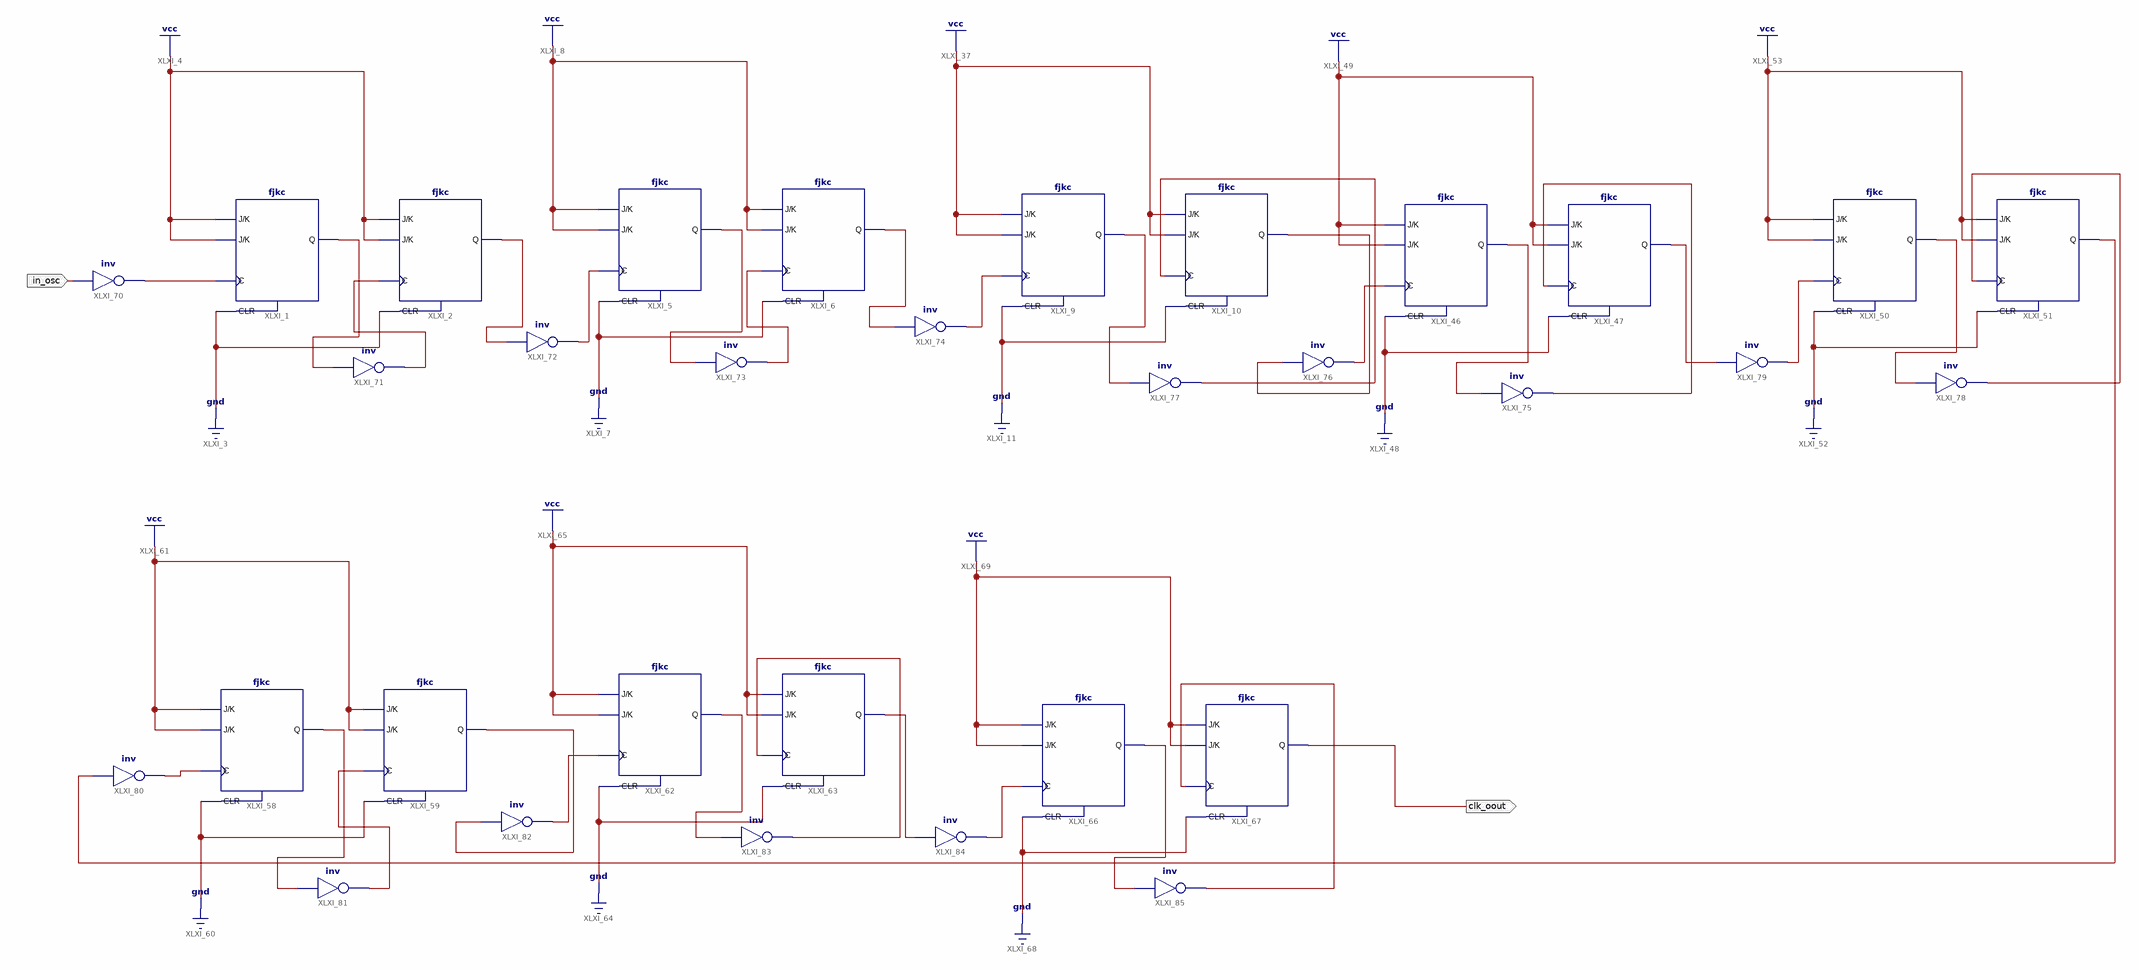
[diagram p0: schematic sheet 1]
// Xilinx ISE schematic clk_2_16.sch (spartan6) as structural Verilog: 32 symbols, 2 ports
module clk_2_16 (
  input  in_osc,
  output clk_oout
);

  wire XLXN_86, XLXN_87, XLXN_88, XLXN_89, XLXN_90, XLXN_91, XLXN_92, XLXN_93, XLXN_94, XLXN_95, XLXN_96,
       XLXN_98, XLXN_100, XLXN_101, XLXN_102, XLXN_103, XLXN_104, XLXN_105, XLXN_106, XLXN_107, XLXN_108,
       XLXN_110, XLXN_111, XLXN_112, XLXN_113, XLXN_114, XLXN_115, XLXN_116, XLXN_117, XLXN_118, XLXN_119;

  fjkc XLXI_1 (.C(XLXN_86), .CLR(1'b0), .J(1'b1), .K(1'b1), .Q(XLXN_87));
  fjkc XLXI_2 (.C(XLXN_88), .CLR(1'b0), .J(1'b1), .K(1'b1), .Q(XLXN_89));
  fjkc XLXI_5 (.C(XLXN_90), .CLR(1'b0), .J(1'b1), .K(1'b1), .Q(XLXN_91));
  fjkc XLXI_6 (.C(XLXN_92), .CLR(1'b0), .J(1'b1), .K(1'b1), .Q(XLXN_93));
  fjkc XLXI_9 (.C(XLXN_94), .CLR(1'b0), .J(1'b1), .K(1'b1), .Q(XLXN_95));
  fjkc XLXI_10 (.C(XLXN_96), .CLR(1'b0), .J(1'b1), .K(1'b1), .Q(XLXN_98));
  fjkc XLXI_46 (.C(XLXN_100), .CLR(1'b0), .J(1'b1), .K(1'b1), .Q(XLXN_101));
  fjkc XLXI_47 (.C(XLXN_102), .CLR(1'b0), .J(1'b1), .K(1'b1), .Q(XLXN_103));
  fjkc XLXI_50 (.C(XLXN_104), .CLR(1'b0), .J(1'b1), .K(1'b1), .Q(XLXN_105));
  fjkc XLXI_51 (.C(XLXN_106), .CLR(1'b0), .J(1'b1), .K(1'b1), .Q(XLXN_108));
  fjkc XLXI_58 (.C(XLXN_107), .CLR(1'b0), .J(1'b1), .K(1'b1), .Q(XLXN_110));
  fjkc XLXI_59 (.C(XLXN_111), .CLR(1'b0), .J(1'b1), .K(1'b1), .Q(XLXN_112));
  fjkc XLXI_62 (.C(XLXN_113), .CLR(1'b0), .J(1'b1), .K(1'b1), .Q(XLXN_114));
  fjkc XLXI_63 (.C(XLXN_115), .CLR(1'b0), .J(1'b1), .K(1'b1), .Q(XLXN_116));
  fjkc XLXI_66 (.C(XLXN_117), .CLR(1'b0), .J(1'b1), .K(1'b1), .Q(XLXN_118));
  fjkc XLXI_67 (.C(XLXN_119), .CLR(1'b0), .J(1'b1), .K(1'b1), .Q(clk_oout));
  not XLXI_70 (XLXN_86, in_osc);
  not XLXI_71 (XLXN_88, XLXN_87);
  not XLXI_72 (XLXN_90, XLXN_89);
  not XLXI_73 (XLXN_92, XLXN_91);
  not XLXI_74 (XLXN_94, XLXN_93);
  not XLXI_75 (XLXN_102, XLXN_101);
  not XLXI_76 (XLXN_100, XLXN_98);
  not XLXI_77 (XLXN_96, XLXN_95);
  not XLXI_78 (XLXN_106, XLXN_105);
  not XLXI_79 (XLXN_104, XLXN_103);
  not XLXI_80 (XLXN_107, XLXN_108);
  not XLXI_81 (XLXN_111, XLXN_110);
  not XLXI_82 (XLXN_113, XLXN_112);
  not XLXI_83 (XLXN_115, XLXN_114);
  not XLXI_84 (XLXN_117, XLXN_116);
  not XLXI_85 (XLXN_119, XLXN_118);
endmodule
